# EAGLE design pic16f84a (EAGLE 7.1.0)
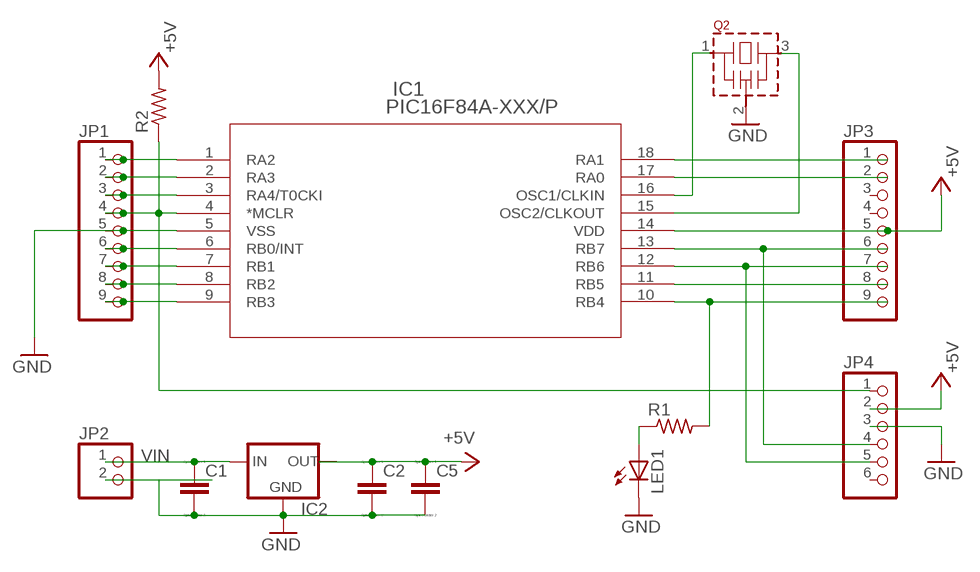
[diagram p0: schematic, sheet 1]

## Parts
C1  C-EU050-025X075  [C050-025X075]
C2  C-EU050-025X075  [C050-025X075]
C5  C-EU050-025X075  [C050-025X075]
IC1  PIC16F84A-XXX/P  [PDIP18_300MC]
IC2  78XXS  [78XXS]
JP1  PINHD-1X9  [1X09]
JP2  PINHD-1X2  [1X02]
JP3  PINHD-1X9  [1X09]
JP4  PINHD-1X6  [1X06]
LED1  LED3MM  [LED3MM]
Q2  CSTLS_X  [CSTLS_X]
R1  R-US_0207/10  [0207/10]
R2  R-US_0207/10  [0207/10]

## Nets
+5V: C2.1 C5.1 IC1.14(VDD) IC2.OUT JP3.5 JP4.2 R2.2
GND: C1.2 C2.2 C5.2 IC1.5(VSS) IC2.GND JP1.5 JP2.2 JP4.3 LED1.K(C) Q2.2(VSS)
N$1: IC1.1(RA2) JP1.1
N$2: IC1.2(RA3) JP1.2
N$3: IC1.3(RA4/T0CKI) JP1.3
N$4: IC1.4(*MCLR) JP1.4 JP4.1 R2.1
N$5: IC1.15(OSC2/CLKOUT) Q2.3
N$6: IC1.6(RB0/INT) JP1.6
N$7: IC1.7(RB1) JP1.7
N$8: IC1.8(RB2) JP1.8
N$9: IC1.9(RB3) JP1.9
N$10: IC1.18(RA1) JP3.1
N$11: IC1.17(RA0) JP3.2
N$12: IC1.12(RB6) JP3.7 JP4.5
N$13: LED1.A R1.1
N$15: IC1.13(RB7) JP3.6 JP4.4
N$17: IC1.11(RB5) JP3.8
N$18: IC1.10(RB4) JP3.9 R1.2
N$23: IC1.16(OSC1/CLKIN) Q2.1
VIN: C1.1 IC2.IN JP2.1
Unconnected: JP3.3 JP3.4 JP4.6

## Library data of the parts
C1 C2 C5 = resistor:C-EU: CAPACITOR, European symbol; SPICEPREFIX: C
IC1 = PIC16F84A:PIC16F84A-XXX/P
IC2 = v-reg:78XXS: VOLTAGE REGULATOR
JP1 JP3 = pinhead:PINHD-1X9: PIN HEADER
JP2 = pinhead:PINHD-1X2: PIN HEADER
JP4 = pinhead:PINHD-1X6: PIN HEADER
LED1 = led:LED: LED OSRAM: - CHIPLED LG R971, LG N971, LY N971, LG Q971, LY Q971, LO R971, LY R971 LH N974, LH R974 LS Q976, LO Q976, LY Q976 LO Q996 - Hyper CHIPLED LW Q18S LB Q993, LB Q99A, LB R99A - SideLED LS A670, LO A670, LY A670, LG A670, LP A670 LB A673, LV A673, LT A673, LW A673 LH A674 LY A675 LS A676, LA A676, LO A676, LY A676, LW A676 LS A679, LY A679, LG A679 - Hyper Micro SIDELED® LS Y876, LA Y876, LO Y876, LY Y876 LT Y87S - SmartLED LW L88C, LW L88S LB L89C, LB L89S, LG L890 LS L89K, LO L89K, LY L89K LS L896, LA L896, LO L896, LY L896 - TOPLED LS T670, LO T670, LY T670, LG T670, LP T670 LSG T670, LSP T670, LSY T670, LOP T670, LYG T670 LG T671, LOG T671, LSG T671 LB T673, LV T673, LT T673, LW T673 LH T674 LS T676, LA T676, LO T676, LY T676, LB T676, LH T676, LSB T676, LW T676 LB T67C, LV T67C, LT T67C, LS T67K, LO T67K, LY T67K, LW E67C LS E67B, LA E67B, LO E67B, LY E67B, LB E67C, LV E67C, LT E67C LW T67C LS T679, LY T679, LG T679 LS T770, LO T770, LY T770, LG T770, LP T770 LB T773, LV T773, LT T773, LW T773 LH T774 LS E675, LA E675, LY E675, LS T675 LS T776, LA T776, LO T776, LY T776, LB T776 LHGB T686 LT T68C, LB T68C - Hyper Mini TOPLED® LB M676 - Mini TOPLED Santana® LG M470 LS M47K, LO M47K, LY M47K Source: http://www.osram.convergy.de LUXEON: - LUMILED® LXK2-PW12-R00, LXK2-PW12-S00, LXK2-PW14-U00, LXK2-PW14-V00 LXK2-PM12-R00, LXK2-PM12-S00, LXK2-PM14-U00 LXK2-PE12-Q00, LXK2-PE12-R00, LXK2-PE12-S00, LXK2-PE14-T00, LXK2-PE14-U00 LXK2-PB12-K00, LXK2-PB12-L00, LXK2-PB12-M00, LXK2-PB14-N00, LXK2-PB14-P00, LXK2-PB14-Q00 LXK2-PR12-L00, LXK2-PR12-M00, LXK2-PR14-Q00, LXK2-PR14-R00 LXK2-PD12-Q00, LXK2-PD12-R00, LXK2-PD12-S00 LXK2-PH12-R00, LXK2-PH12-S00 LXK2-PL12-P00, LXK2-PL12-Q00, LXK2-PL12-R00 Source: www.luxeon.com KINGBRIGHT: KA-3528ASYC Source: www.kingbright.com
Q2 = murata-resonators:CSTLS_X: Ceramic resonator 16.00 to 70.00 MHz
R1 R2 = resistor:R-US_: RESISTOR, American symbol

## Net classes
0 default: clearance 0.205 mm

## Board
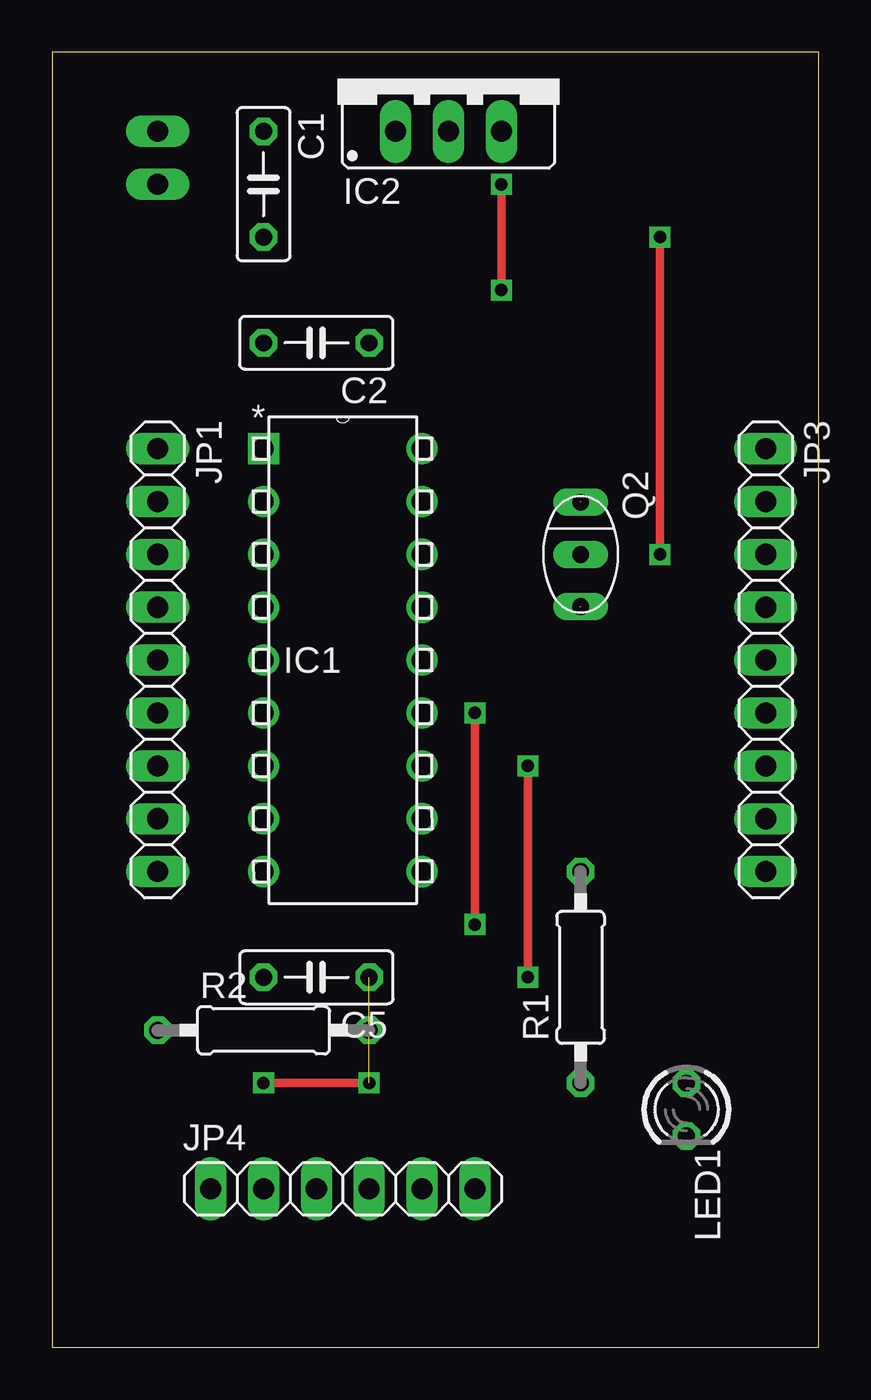
[diagram p1: board, top side]
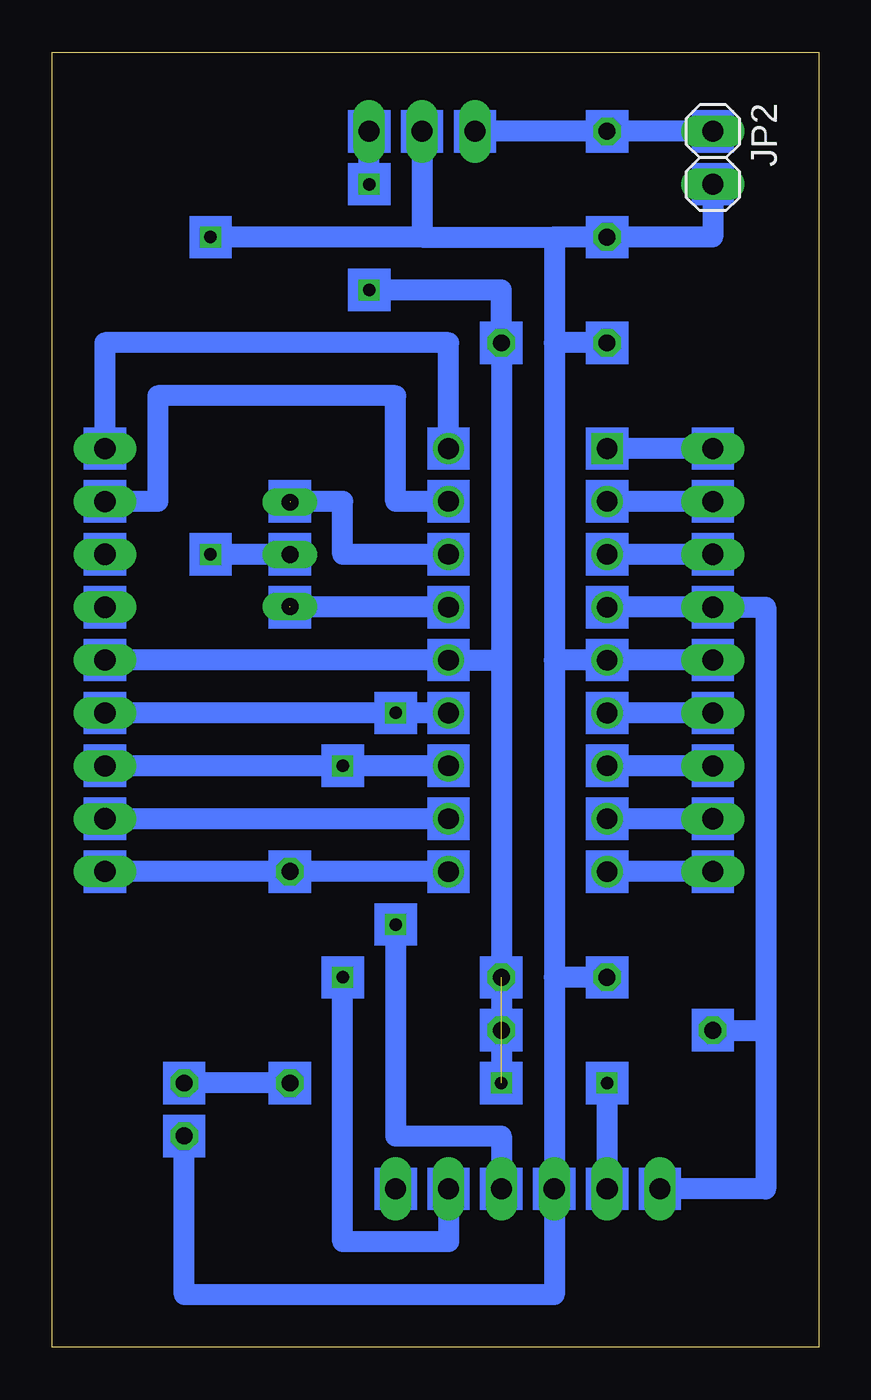
[diagram p2: board, bottom side, seen from below]

Size 36.83 x 62.23 mm. Coordinates in mm from the lower left corner, seen from the top.
Outline: 0,0 36.83,0 36.83,62.23 0,62.23 0,0
Copper layers (1*16): Top 0.035mm / dielectric 1.5mm / Bottom 0.035mm
Design rules "default": minimum track width 10mil, minimum drill 24mil, track to track 8mil, track to pad 8mil, pad to pad 8mil, via to via 8mil, smd to smd 8mil, copper to edge 40mil, drill to drill 8mil, minimum pad ring 10mil, minimum via ring 8mil, stop-mask expansion 4mil, vias tented up to drill 0mil, thermal gap 10mil

### Footprints (pad centres in the part's own frame; a part is rotated, then mirrored left to right if it is on the bottom)
C050-025X075 = drill 0.813 octagon: 1 -2.54,0; 2 2.54,0
PDIP18_300MC = drill 0.991 square: 1 -7.62,20.32 | drill 0.991: 2 -7.62,17.78; 3 -7.62,15.24; 4 -7.62,12.7; 5 -7.62,10.16; 6 -7.62,7.62; 7 -7.62,5.08; 8 -7.62,2.54; 9 -7.62,0; 10 0,0; 11 0,2.54; 12 0,5.08; 13 0,7.62; 14 0,10.16; 15 0,12.7; 16 0,15.24; 17 0,17.78; 18 0,20.32
78XXS = drill 1.016 long: GND 0,-2.54; IN -2.54,-2.54; OUT 2.54,-2.54
1X09 = drill 1.016 long: 1 -10.16,0; 2 -7.62,0; 3 -5.08,0; 4 -2.54,0; 5 0,0; 6 2.54,0; 7 5.08,0; 8 7.62,0; 9 10.16,0
1X02 = drill 1.016 long: 1 -1.27,0; 2 1.27,0
1X06 = drill 1.016 long: 1 -6.35,0; 2 -3.81,0; 3 -1.27,0; 4 1.27,0; 5 3.81,0; 6 6.35,0
LED3MM = drill 0.813 octagon: A -1.27,0; K 1.27,0
CSTLS_X = drill 0.813 long: 1 -2.5,0; 2 0,0; 3 2.5,0
0207/10 = drill 0.813 octagon: 1 -5.08,0; 2 5.08,0

### Placement (x,y rotation side)
C1  10.16,55.88 270 top
C2  12.7,48.26 180 top
C5  12.7,17.78 180 top
IC1  17.78,22.86 0 top
IC2  19.05,60.96 0 top
JP1  5.08,33.02 270 top
JP2  5.08,57.15 270 bottom
JP3  34.29,33.02 270 top
JP4  13.97,7.62 0 top
LED1  30.48,11.43 270 top
Q2  25.4,38.1 270 top
R1  25.4,17.78 90 top
R2  10.16,15.24 0 top

### Tracks (layer width: path | path; a pad name or v marks a point on that pad's centre or on a via)
+5V  (via drill 0.6)  (2 unrouted)
  Top 0.406: v21.59,50.8 v21.59,55.88 | v15.24,12.7 v10.16,12.7
  Bottom 1.016: v21.59,50.8 15.24,50.8 C2.1 15.24,33.02 | v21.59,55.88 IC2.OUT | 15.24,33.02 v15.24,12.7 | v10.16,12.7 JP4.2 | 15.24,33.02 IC1.14 JP3.5
GND  (via drill 0.6)
  Top 0.406: v29.21,53.34 v29.21,38.1
  Bottom 1.016: JP1.5 IC1.5 12.7,33.02 | JP2.2 5.08,53.34 C1.2 12.7,53.34 | 12.7,53.34 12.7,48.26 | 12.7,48.26 12.7,33.02 | 12.7,33.02 12.7,17.78 | 12.7,17.78 JP4.3 12.7,2.54 30.48,2.54 LED1.K | C2.2 12.7,48.26 | IC2.GND 19.05,53.34 | 19.05,53.34 12.7,53.34 | 19.05,53.34 v29.21,53.34 | C5.2 12.7,17.78 | Q2.2 v29.21,38.1
N$1
  Bottom 1.016: JP1.1 IC1.1
N$2
  Bottom 1.016: JP1.2 IC1.2
N$3
  Bottom 1.016: JP1.3 IC1.3
N$4
  Bottom 1.016: IC1.4 JP1.4 2.54,35.56 2.54,15.24 | 2.54,15.24 2.54,7.62 JP4.1 | R2.1 2.54,15.24
N$5  (1 unrouted)
  Bottom 1.016: IC1.15 25.4,35.56
N$6
  Bottom 1.016: JP1.6 IC1.6
N$7
  Bottom 1.016: JP1.7 IC1.7
N$8
  Bottom 1.016: JP1.8 IC1.8
N$9
  Bottom 1.016: JP1.9 IC1.9
N$10
  Bottom 1.016: IC1.18 17.78,48.26 34.29,48.26 JP3.1
N$11
  Bottom 1.016: IC1.17 20.32,40.64 20.32,45.72 31.75,45.72 31.75,40.64 JP3.2
N$12  (via drill 0.6)
  Top 0.406: v22.86,17.78 v22.86,27.94
  Bottom 1.016: IC1.12 v22.86,27.94 JP3.7 | JP4.5 17.78,5.08 22.86,5.08 v22.86,17.78
N$13
  Bottom 1.016: R1.1 LED1.A
N$15  (via drill 0.6)
  Top 0.406: v20.32,30.48 v20.32,20.32
  Bottom 1.016: IC1.13 v20.32,30.48 JP3.6 | v20.32,20.32 20.32,10.16 15.24,10.16 JP4.4
N$17
  Bottom 1.016: IC1.11 JP3.8
N$18
  Bottom 1.016: IC1.10 R1.2 JP3.9
N$23  (1 unrouted)
  Bottom 1.016: IC1.16 22.86,38.1 22.86,40.64 25.4,40.64
VIN
  Bottom 1.016: JP2.1 C1.1 IC2.IN
(copper drawn outside any net)
  shapes: Bottom area x72